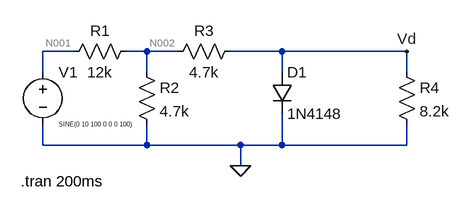
[diagram p0: schematic circuito_2_lab_1.asc]
circuito_2_lab_1.asc, the LTspice schematic file:
Version 4
SHEET 1 880 680
WIRE -48 96 -96 96
WIRE 64 96 32 96
WIRE 112 96 64 96
WIRE 272 96 192 96
WIRE 464 96 272 96
WIRE -96 128 -96 96
WIRE 64 128 64 96
WIRE 272 128 272 96
WIRE 464 128 464 96
WIRE -96 240 -96 208
WIRE 64 240 64 208
WIRE 64 240 -96 240
WIRE 208 240 64 240
WIRE 272 240 272 192
WIRE 272 240 208 240
WIRE 464 240 464 208
WIRE 464 240 272 240
WIRE 208 272 208 240
FLAG 208 272 0
FLAG 464 96 Vd
SYMBOL voltage -96 112 R0
WINDOW 3 24 96 Left 0
WINDOW 123 0 0 Left 0
WINDOW 39 0 0 Left 0
SYMATTR InstName V1
SYMATTR Value SINE(0 10 100 0 0 0 100)
SYMBOL res 48 112 R0
SYMATTR InstName R2
SYMATTR Value 4.7k
SYMBOL res 48 80 R90
WINDOW 0 0 56 VBottom 2
WINDOW 3 32 56 VTop 2
SYMATTR InstName R1
SYMATTR Value 12k
SYMBOL res 208 80 R90
WINDOW 0 0 56 VBottom 2
WINDOW 3 32 56 VTop 2
SYMATTR InstName R3
SYMATTR Value 4.7k
SYMBOL diode 256 128 R0
SYMATTR InstName D1
SYMATTR Value 1N4148
SYMBOL res 448 112 R0
SYMATTR InstName R4
SYMATTR Value 8.2k
TEXT -130 296 Left 2 !.tran 200ms

The netlist it stands for:
* circuito_2_lab_1.asc
V1 N001 0 SINE(0 10 100 0 0 0 100)
R2 N002 0 4.7k
R1 N002 N001 12k
R3 Vd N002 4.7k
D1 Vd 0 1N4148
R4 Vd 0 8.2k
.model D D
.lib standard.dio
.tran 200ms
.backanno
.end

* Results of the author's LTspice run, read from the files saved beside the schematic
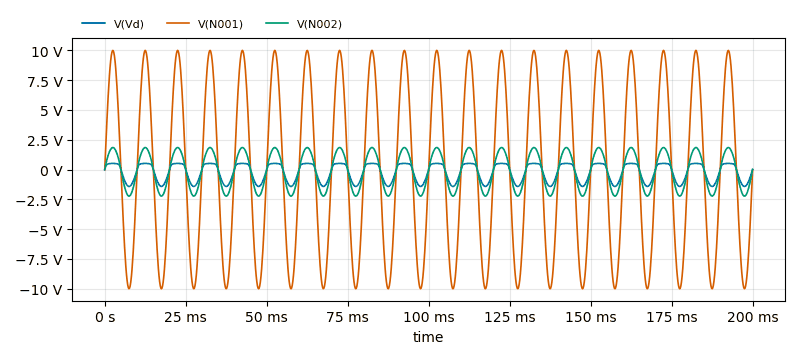
[diagram p1: Transient Analysis of circuito_2_lab_1.asc, plotted from the saved traces]
* Transient Analysis, 1 run:
*   V(Vd): min -1.414 V, max 515.9 mV, average -234.7 mV, rms 774.2 mV, last -14.12 µV
*   V(N001): min -10 V, max 10 V, average -3.848 µV, rms 7.071 V, last 0 V
*   V(N002): min -2.225 V, max 1.849 V, average -98.14 mV, rms 1.459 V, last -5.905 µV